# Altium project Door-Sense-PCB-V3.PrjPcb
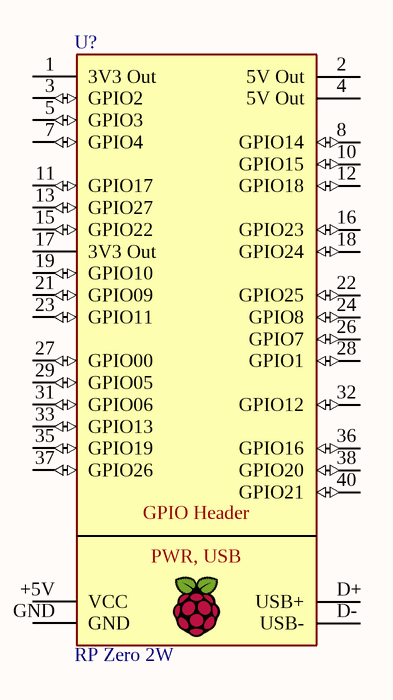
[diagram p0: Pi Zero 2W.SchDoc]
1 sheet, 1 parts. Net scope: global (net labels, ports and power ports of the same name join across sheets).

## Sheet Pi Zero 2W.SchDoc
size B; SheetNumber: 1; SheetTotal: 1

### Parts
U?  RP Zero 2W  [[Device] Raspberry Pi Zero 2W]

### Nets

Not connected (* = marked no-connect by the designer): U? 1(3V3_Out) 2(5V_Out) 3(GPIO2) 4(5V_Out) 5(GPIO3) 7(GPIO4) 8(GPIO14) 10(GPIO15) 11(GPIO17) 12(GPIO18) 13(GPIO27) 15(GPIO22) 16(GPIO23) 17(3V3_Out) 18(GPIO24) 19(GPIO10) 21(GPIO09) 22(GPIO25) 23(GPIO11) 24(GPIO8) 26(GPIO7) 27(GPIO00) 28(GPIO1) 29(GPIO05) 31(GPIO06) 32(GPIO12) 33(GPIO13) 35(GPIO19) 36(GPIO16) 37(GPIO26) 38(GPIO20) 40(GPIO21) +5V(VCC) D+(USB+) D-(USB-) GND

### Notes on the sheet
- (in symbol [Device] Raspberry Pi Zero 2W) GPIO Header; PWR, USB

### Library data of the parts
U? = [Device] Raspberry Pi Zero 2W